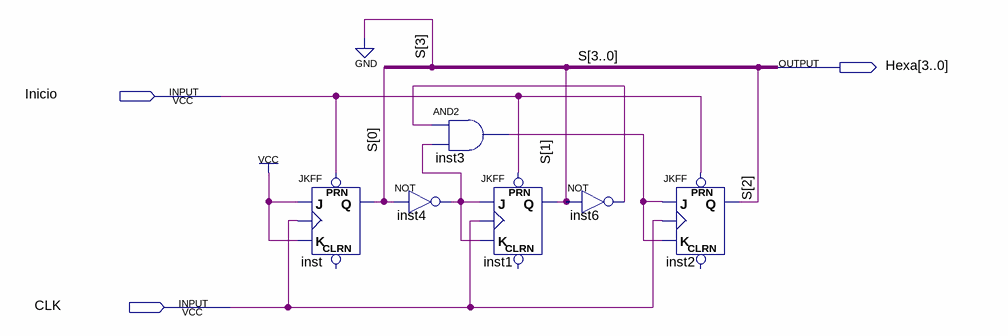
[diagram p0: schematic sheet]
// Quartus schematic LivesCounter.bdf as structural Verilog: 6 symbols, 3 pins
module LivesCounter (
  input  Inicio,
  input  CLK,
  output [3:0] Hexa
);

  wire inst3_out, inst4_out, inst6_out;

  JKFF inst (.PRN(Inicio), .K(1'b1), .J(1'b1), .CLK(CLK), .Q(Hexa[0]));  // open: CLRN
  not inst4 (inst4_out, Hexa[0]);
  and inst3 (inst3_out, inst6_out, inst4_out);
  JKFF inst1 (.PRN(Inicio), .K(inst4_out), .J(inst4_out), .CLK(CLK), .Q(Hexa[1]));  // open: CLRN
  not inst6 (inst6_out, Hexa[1]);
  JKFF inst2 (.PRN(Inicio), .K(inst3_out), .J(inst3_out), .CLK(CLK), .Q(Hexa[2]));  // open: CLRN

  assign Hexa[3] = 1'b0;

  // Other names for the same wires on the sheet: S[2:0] = Hexa[2:0]
endmodule
